# Altium schematic sheet Potencia.SchDoc
size A4
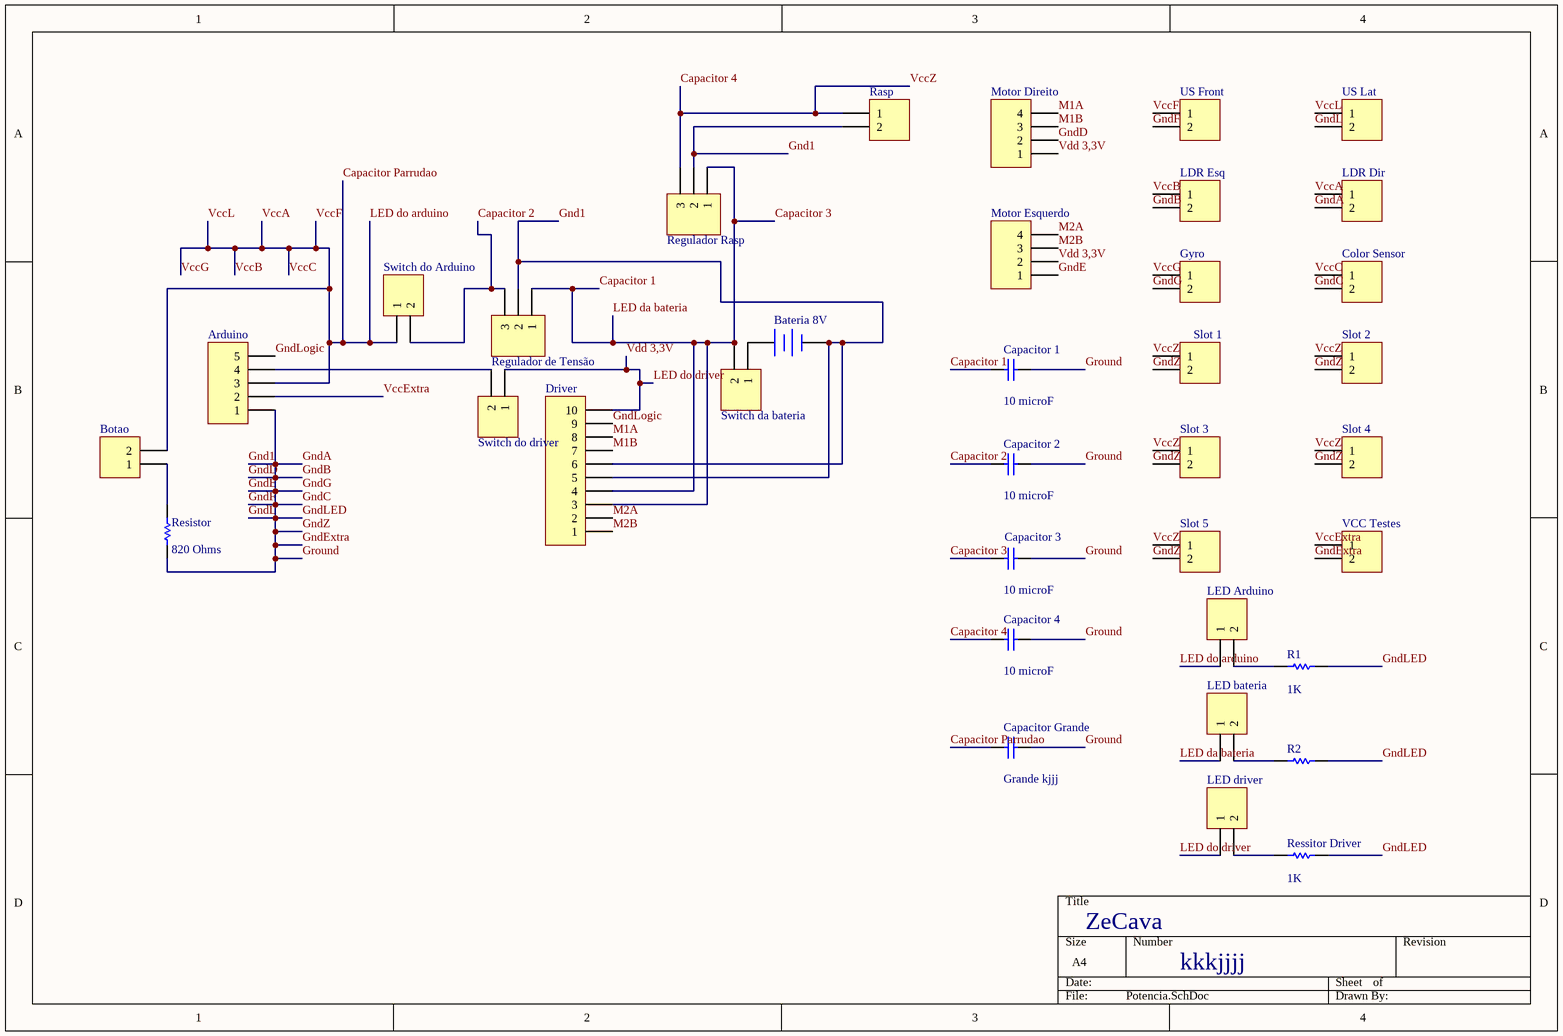
[diagram p0: Potencia.SchDoc]

## Parts
Arduino  Header 5  [HDR1X5]  (value not drawn)
Bateria_8V  Battery  [BAT-2]  (value not drawn)
Botao  Header 2  [HDR1X2]  (value not drawn)
Capacitor_1  value 10 microF  [RAD-0.3]  (hidden comment: Cap)
Capacitor_2  value 10 microF  [RAD-0.3]  (hidden comment: Cap)
Capacitor_3  value 10 microF  [RB7.6-15]  (hidden comment: Cap)
Capacitor_4  value 10 microF  [RAD-0.3]  (hidden comment: Cap)
Capacitor_Grande  value Grande kjjj  [RAD-0.3]  (hidden comment: Cap)
Color_Sensor  Header 2  [HDR1X2]  (value not drawn)
Driver  Header 10  [HDR1X10]  (value not drawn)
Gyro  Header 2  [HDR1X2]  (value not drawn)
LDR_Dir  Header 2  [HDR1X2]  (value not drawn)
LDR_Esq  Header 2  [HDR1X2]  (value not drawn)
LED_Arduino  Header 2  [HDR1X2]  (value not drawn)
LED_bateria  Header 2  [HDR1X2]  (value not drawn)
LED_driver  Header 2  [HDR1X2]  (value not drawn)
Motor_Direito  Header 4  [HDR1X4]  (value not drawn)
Motor_Esquerdo  Header 4  [HDR1X4]  (value not drawn)
R1  value 1K  [AXIAL-0.3]  (hidden comment: Res1)
R2  Res1  [AXIAL-0.3]  (value not drawn)
Rasp  Header 2  [HDR1X2]  (value not drawn)
Regulador_de_Tensão  Header 3  [HDR1X3]  (value not drawn)
Regulador_Rasp  Header 3  [HDR1X3]  (value not drawn)
Resistor  value 820 Ohms  [AXIAL-0.3]  (hidden comment: Res1)
Ressitor_Driver  value 1K  [AXIAL-0.3]  (hidden comment: Res1)
Slot_1  Header 2  [HDR1X2]  (value not drawn)
Slot_2  Header 2  [HDR1X2]  (value not drawn)
Slot_3  Header 2  [HDR1X2]  (value not drawn)
Slot_4  Header 2  [HDR1X2]  (value not drawn)
Slot_5  Header 2  [HDR1X2]  (value not drawn)
Switch_da_bateria  Header 2  [HDR1X2]  (value not drawn)
Switch_do_Arduino  Header 2  [HDR1X2]  (value not drawn)
Switch_do_driver  Header 2  [HDR1X2]  (value not drawn)
US_Front  Header 2  [HDR1X2]  (value not drawn)
US_Lat  Header 2  [HDR1X2]  (value not drawn)
VCC_Testes  Header 2  [HDR1X2]  (value not drawn)

## Nets
Capacitor 1: Capacitor_1.1 Capacitor_3.1 Driver.3 Driver.4 LED_bateria.1 Regulador_de_Tensão.1 Regulador_Rasp.1 Switch_da_bateria.2  [also labelled Capacitor 3, LED da bateria]
Capacitor 2: Capacitor_2.1 Regulador_de_Tensão.3 Switch_do_Arduino.2
Capacitor 4: Capacitor_4.1 Rasp.1 Regulador_Rasp.3 Slot_1.1 Slot_2.1 Slot_3.1 Slot_4.1 Slot_5.1  [also labelled VccZ]
Capacitor Parrudao: Arduino.3 Botao.2 Capacitor_Grande.1 Color_Sensor.1 Gyro.1 LDR_Dir.1 LDR_Esq.1 LED_Arduino.1 Switch_do_Arduino.1 US_Front.1 US_Lat.1  [also labelled LED do arduino, VccA, VccB, VccC, VccF, VccG, VccL]
Gnd1: Arduino.1 Bateria_8V.2(-) Capacitor_1.2 Capacitor_2.2 Capacitor_3.2 Capacitor_4.2 Capacitor_Grande.2 Color_Sensor.2 Driver.5 Driver.6 Gyro.2 LDR_Dir.2 LDR_Esq.2 Motor_Direito.2 Motor_Esquerdo.1 R1.2 R2.2 Rasp.2 Regulador_de_Tensão.2 Regulador_Rasp.2 Resistor.1 Ressitor_Driver.2 Slot_1.2 Slot_2.2 Slot_3.2 Slot_4.2 Slot_5.2 US_Front.2 US_Lat.2 VCC_Testes.2  [also labelled GndA, GndB, GndC, GndD, GndE, GndExtra, GndF, GndG, GndL, GndLED, GndZ, Ground]
GndLogic: Arduino.5 Driver.9
LED do driver: Driver.10 LED_driver.1 Motor_Direito.1 Motor_Esquerdo.2 Switch_do_driver.1  [also labelled Vdd 3,3V]
M1A: Driver.8 Motor_Direito.4
M1B: Driver.7 Motor_Direito.3
M2A: Driver.2 Motor_Esquerdo.4
M2B: Driver.1 Motor_Esquerdo.3
VccExtra: Arduino.2 VCC_Testes.1
NetArduino_4: Arduino.4 Switch_do_driver.2
NetBateria_8V_1: Bateria_8V.1(+) Switch_da_bateria.1
NetBotao_1: Botao.1 Resistor.2
NetLED_Arduino_2: LED_Arduino.2 R1.1
NetLED_bateria_2: LED_bateria.2 R2.1
NetLED_driver_2: LED_driver.2 Ressitor_Driver.1

## Notes on the sheet
- ZeCava
- kkkjjjj

## Library data of the parts
Arduino = Header 5: Header, 5-Pin; LatestRevisionDate: 17-Jul-2002; LatestRevisionNote: Re-released for DXP Platform.; Publisher: Altium Limited
Bateria_8V = Battery: Multicell Battery; Published: 24-Mar-1999; LatestRevisionDate: 17-Jul-2002; LatestRevisionNote: Re-released for DXP Platform.; PackageReference: BAT-2; Publisher: Altium Limited; PackageDescription: Battery; 2 Leads
Botao Color_Sensor Gyro LDR_Dir LDR_Esq LED_Arduino LED_bateria LED_driver Rasp Slot_1-Slot_5 Switch_da_bateria Switch_do_Arduino Switch_do_driver US_Front US_Lat VCC_Testes = Header 2: Header, 2-Pin; LatestRevisionDate: 17-Jul-2002; LatestRevisionNote: Re-released for DXP Platform.; Publisher: Altium Limited
Capacitor_1-Capacitor_4 Capacitor_Grande = Cap: Capacitor; Published: 8-Jun-2000; LatestRevisionDate: 17-Jul-2002; LatestRevisionNote: Re-released for DXP Platform.; PackageReference: RAD-0.3; Publisher: Altium Limited; PackageDescription: Radial Cap, Thru-Hole; 2 Leads; 0.3 in Pin Spacing
Driver = Header 10: Header, 10-Pin; LatestRevisionDate: 17-Jul-2002; LatestRevisionNote: Re-released for DXP Platform.; Publisher: Altium Limited
Motor_Direito Motor_Esquerdo = Header 4: Header, 4-Pin; LatestRevisionDate: 17-Jul-2002; LatestRevisionNote: Re-released for DXP Platform.; Publisher: Altium Limited
R1 R2 Resistor Ressitor_Driver = Res1: Resistor; Published: 8-Jun-2000; LatestRevisionDate: 17-Jul-2002; LatestRevisionNote: Re-released for DXP Platform.; PackageReference: AXIAL-0.3; Publisher: Altium Limited; PackageDescription: Axial Device, Thru-Hole; 2 Leads; 0.3 in Pin Spacing
Regulador_de_Tensão Regulador_Rasp = Header 3: Header, 3-Pin; LatestRevisionDate: 17-Jul-2002; LatestRevisionNote: Re-released for DXP Platform.; Publisher: Altium Limited